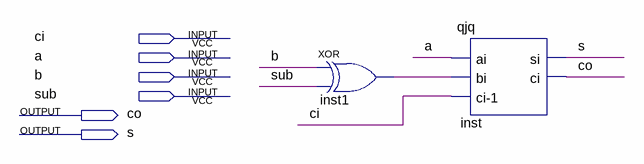
[diagram p0: schematic sheet]
// Quartus schematic jjdy.bdf as structural Verilog: 2 symbols, 6 pins
module jjdy (
  input  ci,
  input  a,
  input  b,
  input  sub,
  output co,
  output s
);

  wire inst1_out;

  xor inst1 (inst1_out, b, sub);
  qjq inst (.ai(a), .bi(inst1_out), .\ci-1 (ci), .si(s), .ci(co));
endmodule
